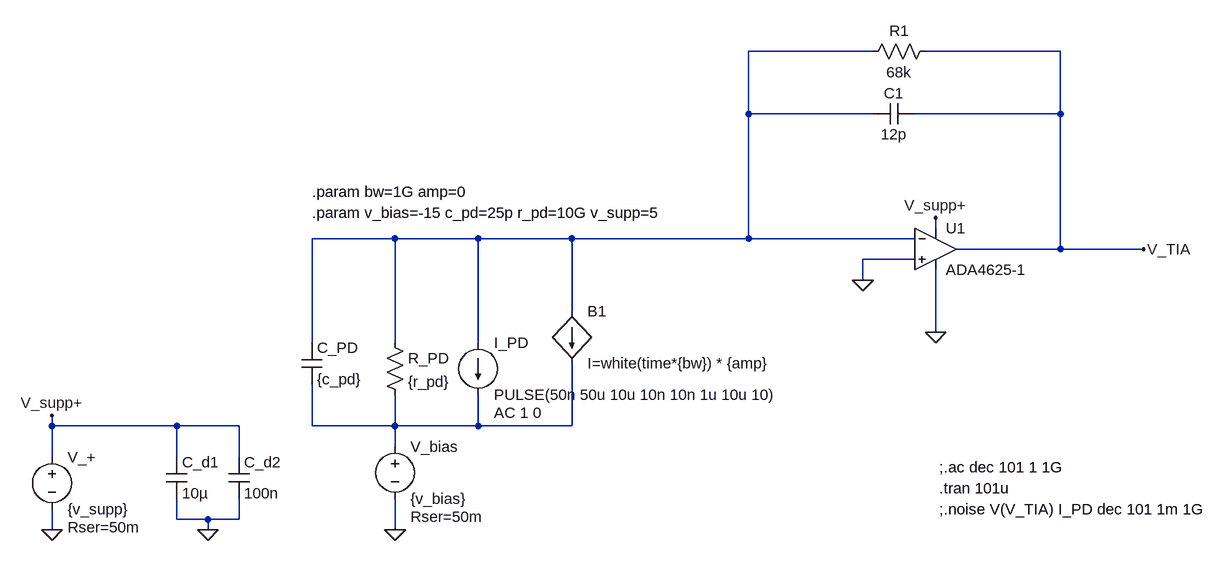
[diagram p0: schematic photodiode-sim.asc]
photodiode-sim.asc, the LTspice schematic file:
Version 4
SHEET 1 1596 680
WIRE 1056 -320 864 -320
WIRE 1344 -320 1136 -320
WIRE 864 -224 864 -320
WIRE 1056 -224 864 -224
WIRE 1344 -224 1344 -320
WIRE 1344 -224 1120 -224
WIRE 1152 -48 1152 -64
WIRE 320 -32 192 -32
WIRE 448 -32 320 -32
WIRE 592 -32 448 -32
WIRE 864 -32 864 -224
WIRE 864 -32 592 -32
WIRE 1120 -32 864 -32
WIRE 1344 -16 1344 -224
WIRE 1344 -16 1184 -16
WIRE 1472 -16 1344 -16
WIRE 1120 0 1040 0
WIRE 1040 32 1040 0
WIRE 592 80 592 -32
WIRE 1152 112 1152 16
WIRE 192 128 192 -32
WIRE 320 128 320 -32
WIRE 448 128 448 -32
WIRE -208 256 -208 240
WIRE -16 256 -208 256
WIRE 80 256 -16 256
WIRE 192 256 192 192
WIRE 320 256 320 208
WIRE 320 256 192 256
WIRE 448 256 448 208
WIRE 448 256 320 256
WIRE 592 256 592 160
WIRE 592 256 448 256
WIRE 320 288 320 256
WIRE -208 304 -208 256
WIRE -16 304 -16 256
WIRE 80 304 80 256
WIRE -16 400 -16 368
WIRE 32 400 -16 400
WIRE 80 400 80 368
WIRE 80 400 32 400
WIRE -208 416 -208 384
WIRE 32 416 32 400
WIRE 320 416 320 368
FLAG 320 416 0
FLAG 1040 32 0
FLAG 32 416 0
FLAG -208 416 0
FLAG -208 240 V_supp+
FLAG 1152 -64 V_supp+
FLAG 1152 112 0
FLAG 1472 -16 V_TIA
SYMBOL cap 176 128 R0
SYMATTR InstName C_PD
SYMATTR Value {c_pd}
SYMBOL res 304 112 R0
SYMATTR InstName R_PD
SYMATTR Value {r_pd}
SYMBOL current 448 128 R0
WINDOW 123 24 108 Left 2
WINDOW 39 0 0 Left 0
SYMATTR InstName I_PD
SYMATTR Value PULSE(50n 50u 10u 10n 10n 1u 10u 10)
SYMATTR Value2 AC 1 0
SYMBOL voltage 320 272 R0
WINDOW 123 0 0 Left 0
WINDOW 39 24 124 Left 2
SYMATTR InstName V_bias
SYMATTR Value {v_bias}
SYMATTR SpiceLine Rser=50m
SYMBOL OpAmps\\ADA4625-1 1152 -80 R0
SYMATTR InstName U1
SYMBOL cap -32 304 R0
SYMATTR InstName C_d1
SYMATTR Value 10µ
SYMBOL cap 64 304 R0
SYMATTR InstName C_d2
SYMATTR Value 100n
SYMBOL voltage -208 288 R0
WINDOW 123 0 0 Left 0
WINDOW 39 24 124 Left 2
SYMATTR InstName V_+
SYMATTR Value {v_supp}
SYMATTR SpiceLine Rser=50m
SYMBOL cap 1120 -240 R90
WINDOW 0 0 32 VBottom 2
WINDOW 3 32 32 VTop 2
SYMATTR InstName C1
SYMATTR Value 12p
SYMBOL res 1152 -336 R90
WINDOW 0 0 56 VBottom 2
WINDOW 3 32 56 VTop 2
SYMATTR InstName R1
SYMATTR Value 68k
SYMBOL bi 592 80 R0
SYMATTR InstName B1
SYMATTR Value I=white(time*{bw}) * {amp}
TEXT 192 -72 Left 2 !.param v_bias=-15 c_pd=25p r_pd=10G v_supp=5
TEXT 1158 352 Left 2 !.tran 101u
TEXT 1158 320 Left 2 !;.ac dec 101 1 1G
TEXT 1158 384 Left 2 !;.noise V(V_TIA) I_PD dec 101 1m 1G
TEXT 192 -104 Left 2 !.param bw=1G amp=0

The netlist it stands for:
* photodiode-sim.asc
C_PD N001 N002 {c_pd}
R_PD N001 N002 {r_pd}
I_PD N001 N002 PULSE(50n 50u 10u 10n 10n 1u 10u 10) AC 1 0
V_bias N002 0 {v_bias} Rser=50m
XU1 0 N001 V_supp+ 0 V_TIA ADA4625-1  ; pins In+ In- V+ V- OUT
C_d1 V_supp+ 0 10µ
C_d2 V_supp+ 0 100n
V_+ V_supp+ 0 {v_supp} Rser=50m
C1 V_TIA N001 12p
R1 V_TIA N001 68k
B1 N001 N002 I=white(time*{bw}) * {amp}
.param v_bias=-15 c_pd=25p r_pd=10G v_supp=5
.tran 101u
;.ac dec 101 1 1G
;.noise V(V_TIA) I_PD dec 101 1m 1G
.param bw=1G amp=0
.backanno
.end